# Altium schematic sheet M3_LO.SchDoc
size B; Organization: Altium Limited; Address1: L3, 12a Rodborough Rd; Address2: Frenchs Forest; Address3: NSW; Address4: Australia 2086
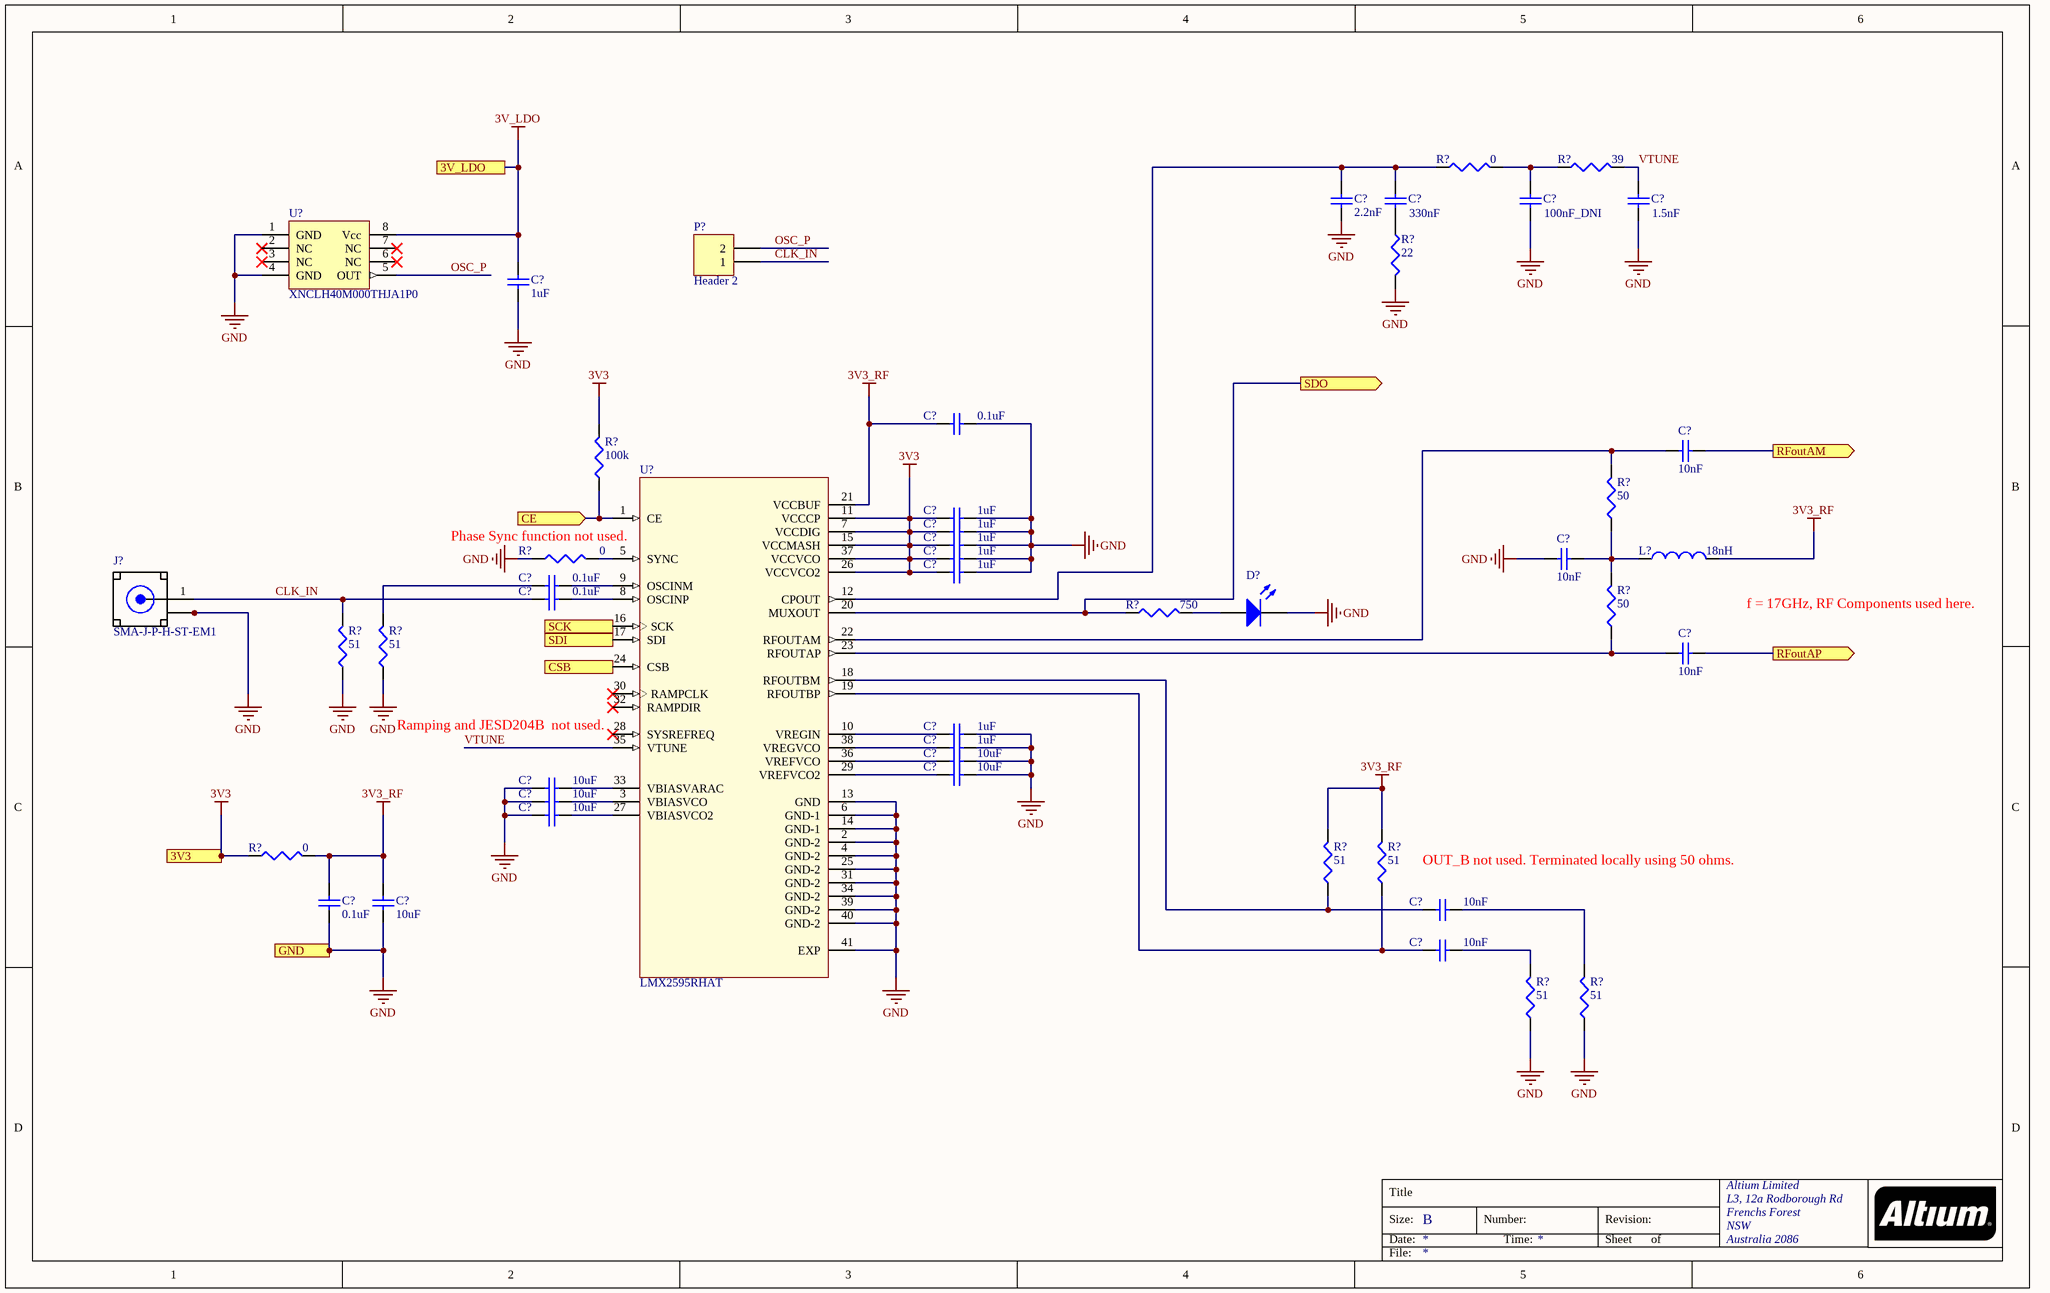
[diagram p0: M3_LO.SchDoc]

## Parts
(Parts that share a designator on the sheet are numbered #1, #2 ... from top to bottom, then left to right.)
C?#1  2.2nF  [SMD-0603]
C?#2  330nF  [SMD-0603]
C?#3  100nF_DNI  [SMD-0603]
C?#4  1.5nF  [SMD-0603]
C?#5  1uF  [SMD-0603]
C?#6  0.1uF  [SMD-0603]
C?#7  10nF  [SMD-0402]
C?#8  1uF  [SMD-0603]
C?#9  1uF  [SMD-0603]
C?#10  1uF  [SMD-0603]
C?#11  1uF  [SMD-0603]
C?#12  10nF  [SMD-0402]
C?#13  1uF  [SMD-0603]
C?#14  0.1uF  [Johanson-0201]
C?#15  0.1uF  [Johanson-0201]
C?#16  10nF  [SMD-0402]
C?#17  1uF  [SMD-0603]
C?#18  1uF  [SMD-0603]
C?#19  10uF  [SMD-0603]
C?#20  10uF  [SMD-0603]
C?#21  10uF  [SMD-0603]
C?#22  10uF  [SMD-0603]
C?#23  10uF  [SMD-0603]
C?#24  0.1uF  [SMD-0603]
C?#25  10uF  [SMD-0805]
C?#26  10nF  [SMD-0402]
C?#27  10nF  [SMD-0402]
D?  LED0603  [LED-SMD-0603]  (value not drawn)
J?  SMA-J-P-H-ST-EM1  [SMA-J-P-H-ST-EM1]
L?  18nH  [SMD-0402]
P?  Header 2  [HDR1X2]
R?#1  0  [SMD-0603]
R?#2  39  [SMD-0603]
R?#3  22  [SMD-0603]
R?#4  100k  [SMD-0603]
R?#5  50  [SMD-0402]
R?#6  0  [SMD-0603]
R?#7  50  [SMD-0402]
R?#8  750  [SMD-0603]
R?#9  51  [Johanson-0201]
R?#10  51  [Johanson-0201]
R?#11  0  [SMD-0603]
R?#12  51  [SMD-0402]
R?#13  51  [SMD-0402]
R?#14  51  [SMD-0402]
R?#15  51  [SMD-0402]
U?#1  XNCLH40M000THJA1P0  [OSC_XNCLH40M000THJA1P0]
U?#2  LMX2595RHAT  [LMX2595RHAT]

## Ports
3V3, 3V_LDO, CE (in), CSB (in), GND, RFoutAM (out), RFoutAP (out), SCK (in), SDI (in), SDO (out)

## Nets
3V3: C?#8.1 C?#9.1 C?#10.1 C?#11.1 C?#13.1 R?#4.2 R?#11.1 U?#2.7(VCCDIG) U?#2.11(VCCCP) U?#2.15(VCCMASH) U?#2.26(VCCVCO2) U?#2.37(VCCVCO) ; port 3V3
3V3_RF: C?#6.1 C?#24.2 C?#25.2 L?.2 R?#11.2 R?#12.2 R?#13.2 U?#2.21(VCCBUF)
3V_LDO: C?#5.2 U?#1.8(Vcc) ; port 3V_LDO
GND: C?#1.1 C?#3.1 C?#4.1 C?#5.1 C?#6.2 C?#8.2 C?#9.2 C?#10.2 C?#11.2 C?#12.1 C?#13.2 C?#17.2 C?#18.2 C?#19.2 C?#20.2 C?#21.1 C?#22.1 C?#23.1 C?#24.1 C?#25.1 D?.2(K) J?.2_1(GND) J?.2_2(GND) J?.3_1(GND) J?.3_2(GND) R?#3.2 R?#6.1 R?#9.1 R?#10.1 R?#14.1 R?#15.1 U?#1.1(GND) U?#1.4(GND) U?#2.2(GND-2) U?#2.4(GND-2) U?#2.6(GND-1) U?#2.13(GND) U?#2.14(GND-1) U?#2.25(GND-2) U?#2.31(GND-2) U?#2.34(GND-2) U?#2.39(GND-2) U?#2.40(GND-2) U?#2.41(EXP) ; port GND
CE: R?#4.1 U?#2.1(CE) ; port CE
CLK_IN: C?#15.1 J?.1(SIGNAL) P?.1 R?#9.2
CSB: U?#2.24(CSB) ; port CSB
OSC_P: P?.2 U?#1.5(OUT)
RFoutAM: C?#7.2 ; port RFoutAM
RFoutAP: C?#16.2 ; port RFoutAP
SCK: U?#2.16(SCK) ; port SCK
SDI: U?#2.17(SDI) ; port SDI
SDO: R?#8.1 U?#2.20(MUXOUT) ; port SDO
VTUNE: C?#4.2 R?#2.2 U?#2.35(VTUNE)
NetC?#1_2: C?#1.2 C?#2.2 R?#1.1 U?#2.12(CPOUT)
NetC?#2_1: C?#2.1 R?#3.1
NetC?#3_2: C?#3.2 R?#1.2 R?#2.1
NetC?#7_1: C?#7.1 R?#5.2 U?#2.22(RFOUTAM)
NetC?#12_2: C?#12.2 L?.1 R?#5.1 R?#7.2
NetC?#14_1: C?#14.1 R?#10.2
NetC?#14_2: C?#14.2 U?#2.9(OSCINM)
NetC?#15_2: C?#15.2 U?#2.8(OSCINP)
NetC?#16_1: C?#16.1 R?#7.1 U?#2.23(RFOUTAP)
NetC?#17_1: C?#17.1 U?#2.10(VREGIN)
NetC?#18_1: C?#18.1 U?#2.38(VREGVCO)
NetC?#19_1: C?#19.1 U?#2.36(VREFVCO)
NetC?#20_1: C?#20.1 U?#2.29(VREFVCO2)
NetC?#21_2: C?#21.2 U?#2.33(VBIASVARAC)
NetC?#22_2: C?#22.2 U?#2.3(VBIASVCO)
NetC?#23_2: C?#23.2 U?#2.27(VBIASVCO2)
NetC?#26_1: C?#26.1 R?#12.1 U?#2.18(RFOUTBM)
NetC?#26_2: C?#26.2 R?#15.2
NetC?#27_1: C?#27.1 R?#13.1 U?#2.19(RFOUTBP)
NetC?#27_2: C?#27.2 R?#14.2
NetD?_1: D?.1(A) R?#8.2
NetR?#6_2: R?#6.2 U?#2.5(SYNC)

Not connected (* = marked no-connect by the designer): U?#1 2(NC)* 3(NC)* 6(NC)* 7(NC)*; U?#2 28(SYSREFREQ)* 30(RAMPCLK)* 32(RAMPDIR)*

## Notes on the sheet
- (near U?#2) Phase Sync function not used.
- f = 17GHz, RF Components used here.
- (near U?#2) Ramping and JESD204B  not used.
- OUT_B not used. Terminated locally using 50 ohms.
- Title
- Size:
- Date:
- B
- Number:
- Time:
- Revision:
- Sheet
- of
- File:

## Library data of the parts
C?#1-C?#6 C?#8-C?#11 C?#13 C?#17-C?#24 = CAP0603: Ceramic Capacitor 0603
C?#7 C?#12 C?#16 = CAP_RF_0402: Broadband Ceramic Capacitor X7R 0402 (1005 Metric)
C?#14 C?#15 = CAP0201: Capacitor 0201 Imperial
C?#25 = CAP0805: Ceramic Capacitor 0805 Imperial (2012 Metric)
C?#26 C?#27 = CAP0402: Ceramic Capacitor 0402
D? = LED0603: LED 0603
J? = SMA-J-P-H-ST-EM1: Connector SMA F 50Ohm Solder ST Edge Mount Gold Over Nickel Tray; MF: Samtec; Price: None; SnapEDA_Link: https://www.snapeda.com/parts/SMA-J-P-H-ST-EM1/Samtec%20Inc./view-part/?ref=snap; MP: SMA-J-P-H-ST-EM1; Package: None; Availability: Unavailable; Value: *
L? = L0402: Inductor 0402
P? = Header 2: Header, 2-Pin; LatestRevisionDate: 17-Jul-2002; LatestRevisionNote: Re-released for DXP Platform.; Publisher: Altium Limited
R?#1-R?#4 R?#6 R?#8 R?#11 = RES0603: Resistor-0603
R?#5 R?#7 = RES_RF_0402: High Frequency Resistor 0402
R?#9 R?#10 = RES0201: Resistor-0201
R?#12-R?#15 = RES0402: Resistor-0402
U?#1 = XNCLH40M000THJA1P0: Frequency: 40.000000MHz Size: 5.0 x 3.2mm), Frequency Tolerance ±0.5ppm, Temperature ±0.2ppm
U?#2 = LMX2595RHAT: 10 MHz - 19 GHz Wideband RF Synthesizer with Phase Synchronization and JESD204B support 40-VQFN -40 to 85; MF: Texas Instruments; Digi-Key_Part_Number: 296-47001-1-ND; MP: LMX2595RHAT; SnapEDA_Link: https://www.snapeda.com/parts/LMX2595RHAT/Texas%20Instruments/view-part/?ref=snap; Package: VQFN-40 Texas Instruments; Digi-Key_Purchase_URL: https://www.digikey.com/product-detail/en/texas-instruments/LMX2595RHAT/296-47001-1-ND/7427008?utm_source=snapeda&utm_medium=aggregator&utm_campaign=symbol; Value: *